# EasyEDA Pro project 小车2.0.eprj

# Schematic Schematic1
Create Date: 2024-05-27; Page Name: P1; Project Name: 小车2.0; Schematic Name: Schematic1; Update Date: 2024-06-13; Add into BOM: yes; Company: 嘉立创EDA; Convert to PCB: yes; Page Size: A4; Version: V1.0
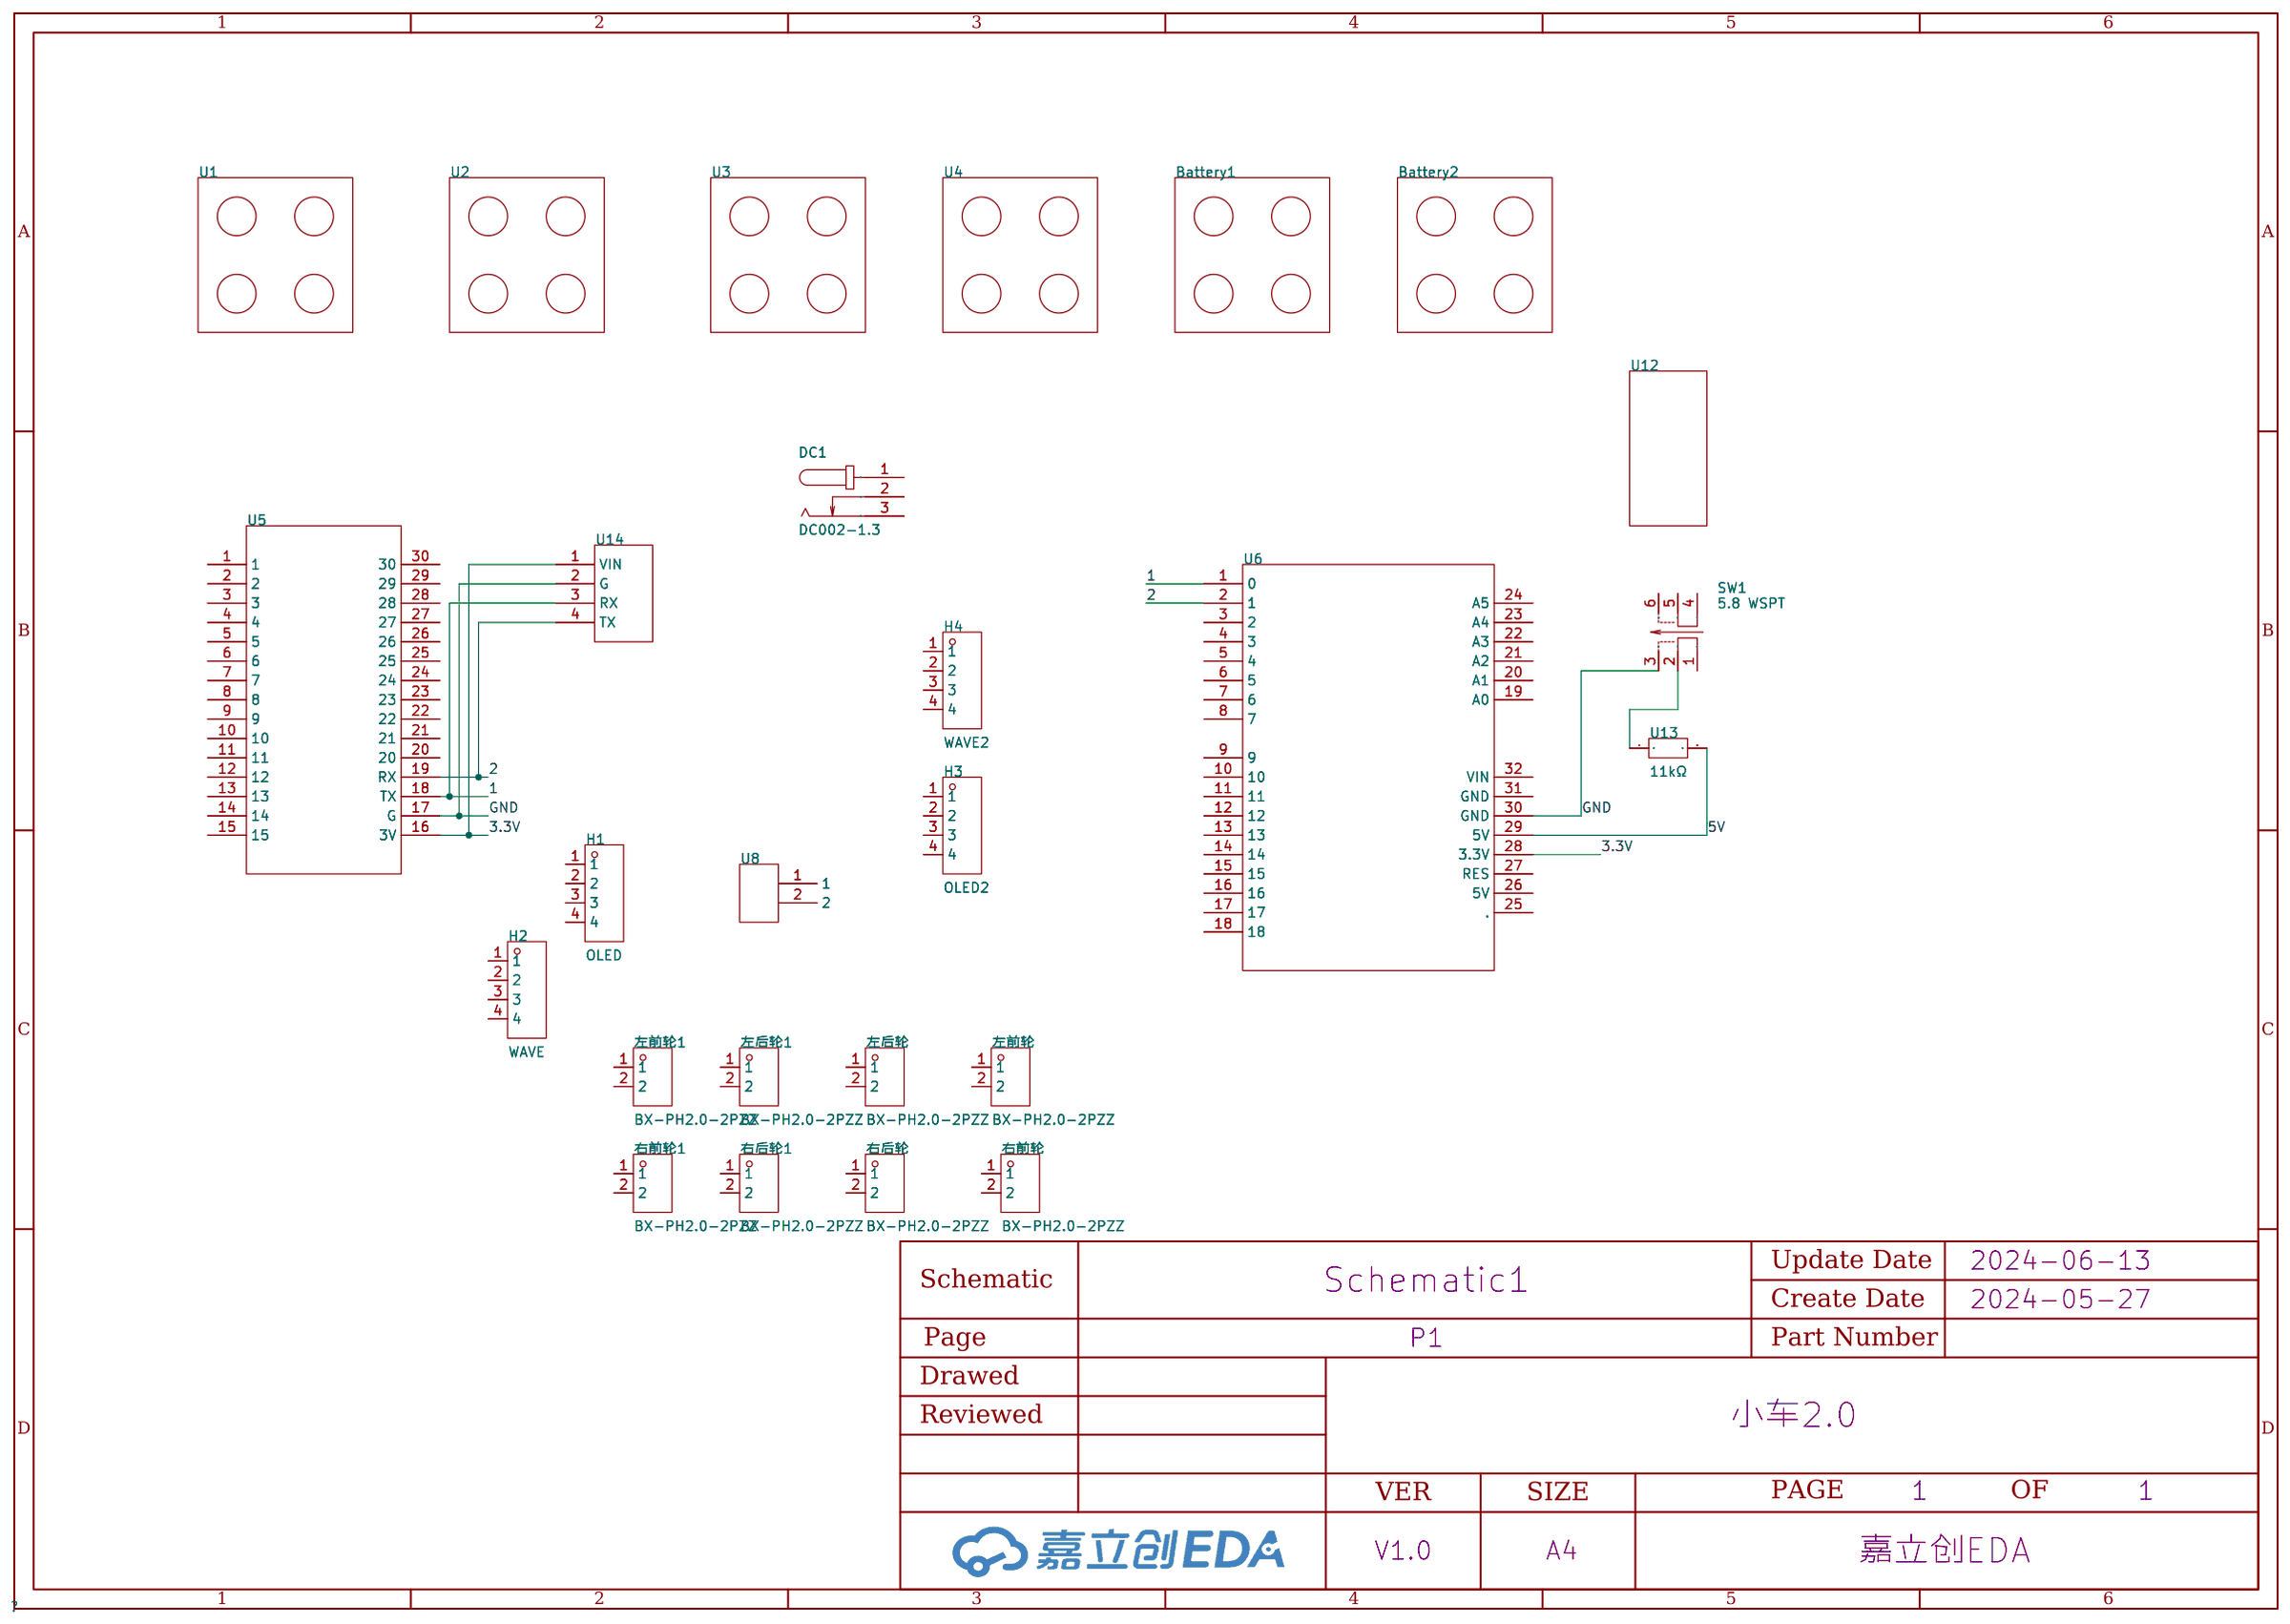
[diagram p0: schematic sheet]

## Parts
Battery1  -  [车轮]
Battery2  -  [车轮]
DC1  DC002-1.3  [DC-IN-TH_DC002-1.3]
H1  OLED  [HDR-TH_4P-P2.54-V-F]
H2  WAVE  [HDR-TH_4P-P2.54-V-F]
H3  OLED2  [HDR-TH_4P-P2.54-V-F]
H4  WAVE2  [HDR-TH_4P-P2.54-V-F]
SW1  5.8 WSPT  [SW-TH_6P-L5.8-W5.8-P2.00-LS4.5-TL_K8-5851E-L1]
U1  -  [车轮]
U2  -  [车轮]
U3  -  [车轮]
U4  -  [车轮]
U5  -  [蓝牙]
U6  -  [开发板]
U8  -  [开关]
U12  -  [舵机]
U13  11kΩ  [RES-TH_BD2.3-L6.0-P10.00-D0.6]
U14  -  [OPENMV]
右前轮  BX-PH2.0-2PZZ  [CONN-TH_2P-P2.00_BOSSIE_BX-PH2.0-2PZZ]
右前轮1  BX-PH2.0-2PZZ  [CONN-TH_2P-P2.00_BOSSIE_BX-PH2.0-2PZZ]
右后轮  BX-PH2.0-2PZZ  [CONN-TH_2P-P2.00_BOSSIE_BX-PH2.0-2PZZ]
右后轮1  BX-PH2.0-2PZZ  [CONN-TH_2P-P2.00_BOSSIE_BX-PH2.0-2PZZ]
左前轮  BX-PH2.0-2PZZ  [CONN-TH_2P-P2.00_BOSSIE_BX-PH2.0-2PZZ]
左前轮1  BX-PH2.0-2PZZ  [CONN-TH_2P-P2.00_BOSSIE_BX-PH2.0-2PZZ]
左后轮  BX-PH2.0-2PZZ  [CONN-TH_2P-P2.00_BOSSIE_BX-PH2.0-2PZZ]
左后轮1  BX-PH2.0-2PZZ  [CONN-TH_2P-P2.00_BOSSIE_BX-PH2.0-2PZZ]

## Library data of the parts
Battery1 Battery2 U1-U4 = 车轮
DC1 = DC002-1.3: 连接器类型:DC电源插座;安装方式:弯插;触点内径:1.3mm;触点外径:4.2mm;额定电流:500mA;额定电压:30V;工作温度范围:-;; LCSC Part Name: DC电源插座 内径:1.3mm 外径:4.2mm; Supplier Part: C668593; Manufacturer: SHOU HAN(首韩); Supplier Footprint: 插件; JLCPCB Part Class: 扩展库; Datasheet: https://atta.szlcsc.com/upload/public/pdf/source/20200619/C668593_6B5785499F122503841AA69BD23A954B.pdf; Supplier: LCSC; Connector Type: DC电源插座; Mounting Style: 弯插; Inside Contact Diameter: 1.3mm; Outside Contact Diameter: 4.2mm; Current Rating (Max): 500mA; Voltage Rating (Max): 30V
H1-H4 = PM254V-11-04-H85: 插孔结构:1x4P;间距:2.54mm;行距:-;安装类型:直插;排数:单排;总孔位数:4P;塑高:-;触头材质:黄铜;触头镀层:-;; LCSC Part Name: 间距:2.54mm 1x4P 直插; Supplier Part: C541851; Manufacturer: XFCN(兴飞); Supplier Footprint: 插件,P=2.54mm; JLCPCB Part Class: 扩展库; Datasheet: https://atta.szlcsc.com/upload/public/pdf/source/20200518/C541849_85853D71FC67C51915A806977A588FDA.pdf; Supplier: LCSC; Holes Structure: 1x4P; Pitch: 2.54mm; Mounting Type: 直插; Number of Rows: 单排; Number of Holes: 4P; Contact Material: 黄铜
SW1 = 5.8 WSPT: 电路结构:双刀双掷;自锁/无锁:无锁;安装方式:直插;触点电流:100mA;额定电压 (AC):-;额定电压 (DC):30V;带灯:不带;作用力:180gf;机械寿命:5千次;; LCSC Part Name: 按键开关5.8x5.8 无锁平头 180gf; Supplier Part: C5379898; Manufacturer: SHOU HAN(首韩); Supplier Footprint: 插件; JLCPCB Part Class: Extended Part; Datasheet: https://atta.szlcsc.com/upload/public/pdf/source/20230323/C831DDA43A625CDC196CB35781CDAE7F.pdf; Supplier: LCSC; Circuit: 双刀双掷; Self Lock / No Lock: 无锁; Actuator Style: 矩形柱塞; Mounting Style: 直插; Contact Current: 100mA; Voltage Rating (DC): 30V; Insulation Resistance: 100MΩ; Actuator/Cap Color: 蓝色; With Lamp: 不带; Pin Style: PC引脚; Operating Force: 180gf; Operating Temperature: -10℃~+70℃; Mechanical Life: 5千次
U5 = 蓝牙
U6 = 开发板
U8 = 开关
U12 = 舵机
U13 = RN55D1102FB14: 电阻类型:金属膜电阻;阻值:11kΩ;精度:±1%;功率:125mW;温度系数:±100ppm/℃;; LCSC Part Name: 金属膜电阻 11kΩ ±1% 125mW; Supplier Part: C1367638; Manufacturer: VISHAY(威世); Supplier Footprint: 插件,D2.3xL6.1mm; JLCPCB Part Class: 扩展库; Datasheet: https://atta.szlcsc.com/upload/public/pdf/source/20210608/50382EE0E4B78D1CB67FEFC4EAC5A602.pdf; Supplier: LCSC; Type: 金属膜电阻; Tolerance: ±1%; Power(Watts): 125mW; Temperature Coefficient: ±100ppm/℃; Operating Temperature Range: -65℃~+175℃
U14 = opnemv
右前轮 右前轮1 右后轮 右后轮1 左前轮 左前轮1 左后轮 左后轮1 = BX-PH2.0-2PZZ: 插针结构:1x2P;间距:2mm;安装方式:直插;参考系列:PH;总PIN数:2P;排数:1;每排PIN数:2;行距:-;额定电流:2A;触头材质:黄铜;触头镀层:锡;工作温度范围:-25℃~+85℃;; Supplier Part: C18077744; Manufacturer: Bossie(博锡); Supplier Footprint: 插件,P=2mm; JLCPCB Part Class: 扩展库; Datasheet: https://atta.szlcsc.com/upload/public/pdf/source/20231017/0F5D8A357D6F7BFB4F7225D5BDBA6EB1.pdf; Supplier: LCSC; Pins Structure: 1x2P; Pitch: 2mm; Mounting Style: 直插; Reference Series: PH; Number of Pins: 2P; Number of Rows: 1; Number of PINs Per Row: 2; Current Rating (Max): 2A; Contact Material: 黄铜; Contact Plating: 锡; Operating Temperature Range: -25℃~+85℃

## Nets
3.3V: U5.16(3V) U6.28(3.3V) U14.1(VIN)
5V: U6.29(5V) U13.2
GND: SW1.3 U5.17(G) U6.30(GND) U14.2(G)
1: U5.18(TX) U6.1(0) U14.3(RX)
2: U5.19(RX) U6.2(1) U14.4(TX)
Net-(SW1-2): SW1.2 U13.1

Not connected (* = marked no-connect by the designer): DC1 1 2 3; H1 1 2 3 4; H2 1 2 3 4; H3 1 2 3 4; H4 1 2 3 4; SW1 1 4 5 6; U5 1 2 3 4 5 6 7 8 9 10 11 12 13 14 15 20 21 22 23 24 25 26 27 28 29 30; U6 3(2) 4(3) 5(4) 6(5) 7(6) 8(7) 9 10 11 12 13 14 15 16 17 18 19(A0) 20(A1) 21(A2) 22(A3) 23(A4) 24(A5) 25(.) 26(5V) 27(RES) 31(GND) 32(VIN); U8 1 2; 右前轮 1 2; 右前轮1 1 2; 右后轮 1 2; 右后轮1 1 2; 左前轮 1 2; 左前轮1 1 2; 左后轮 1 2; 左后轮1 1 2

# Board PCB1
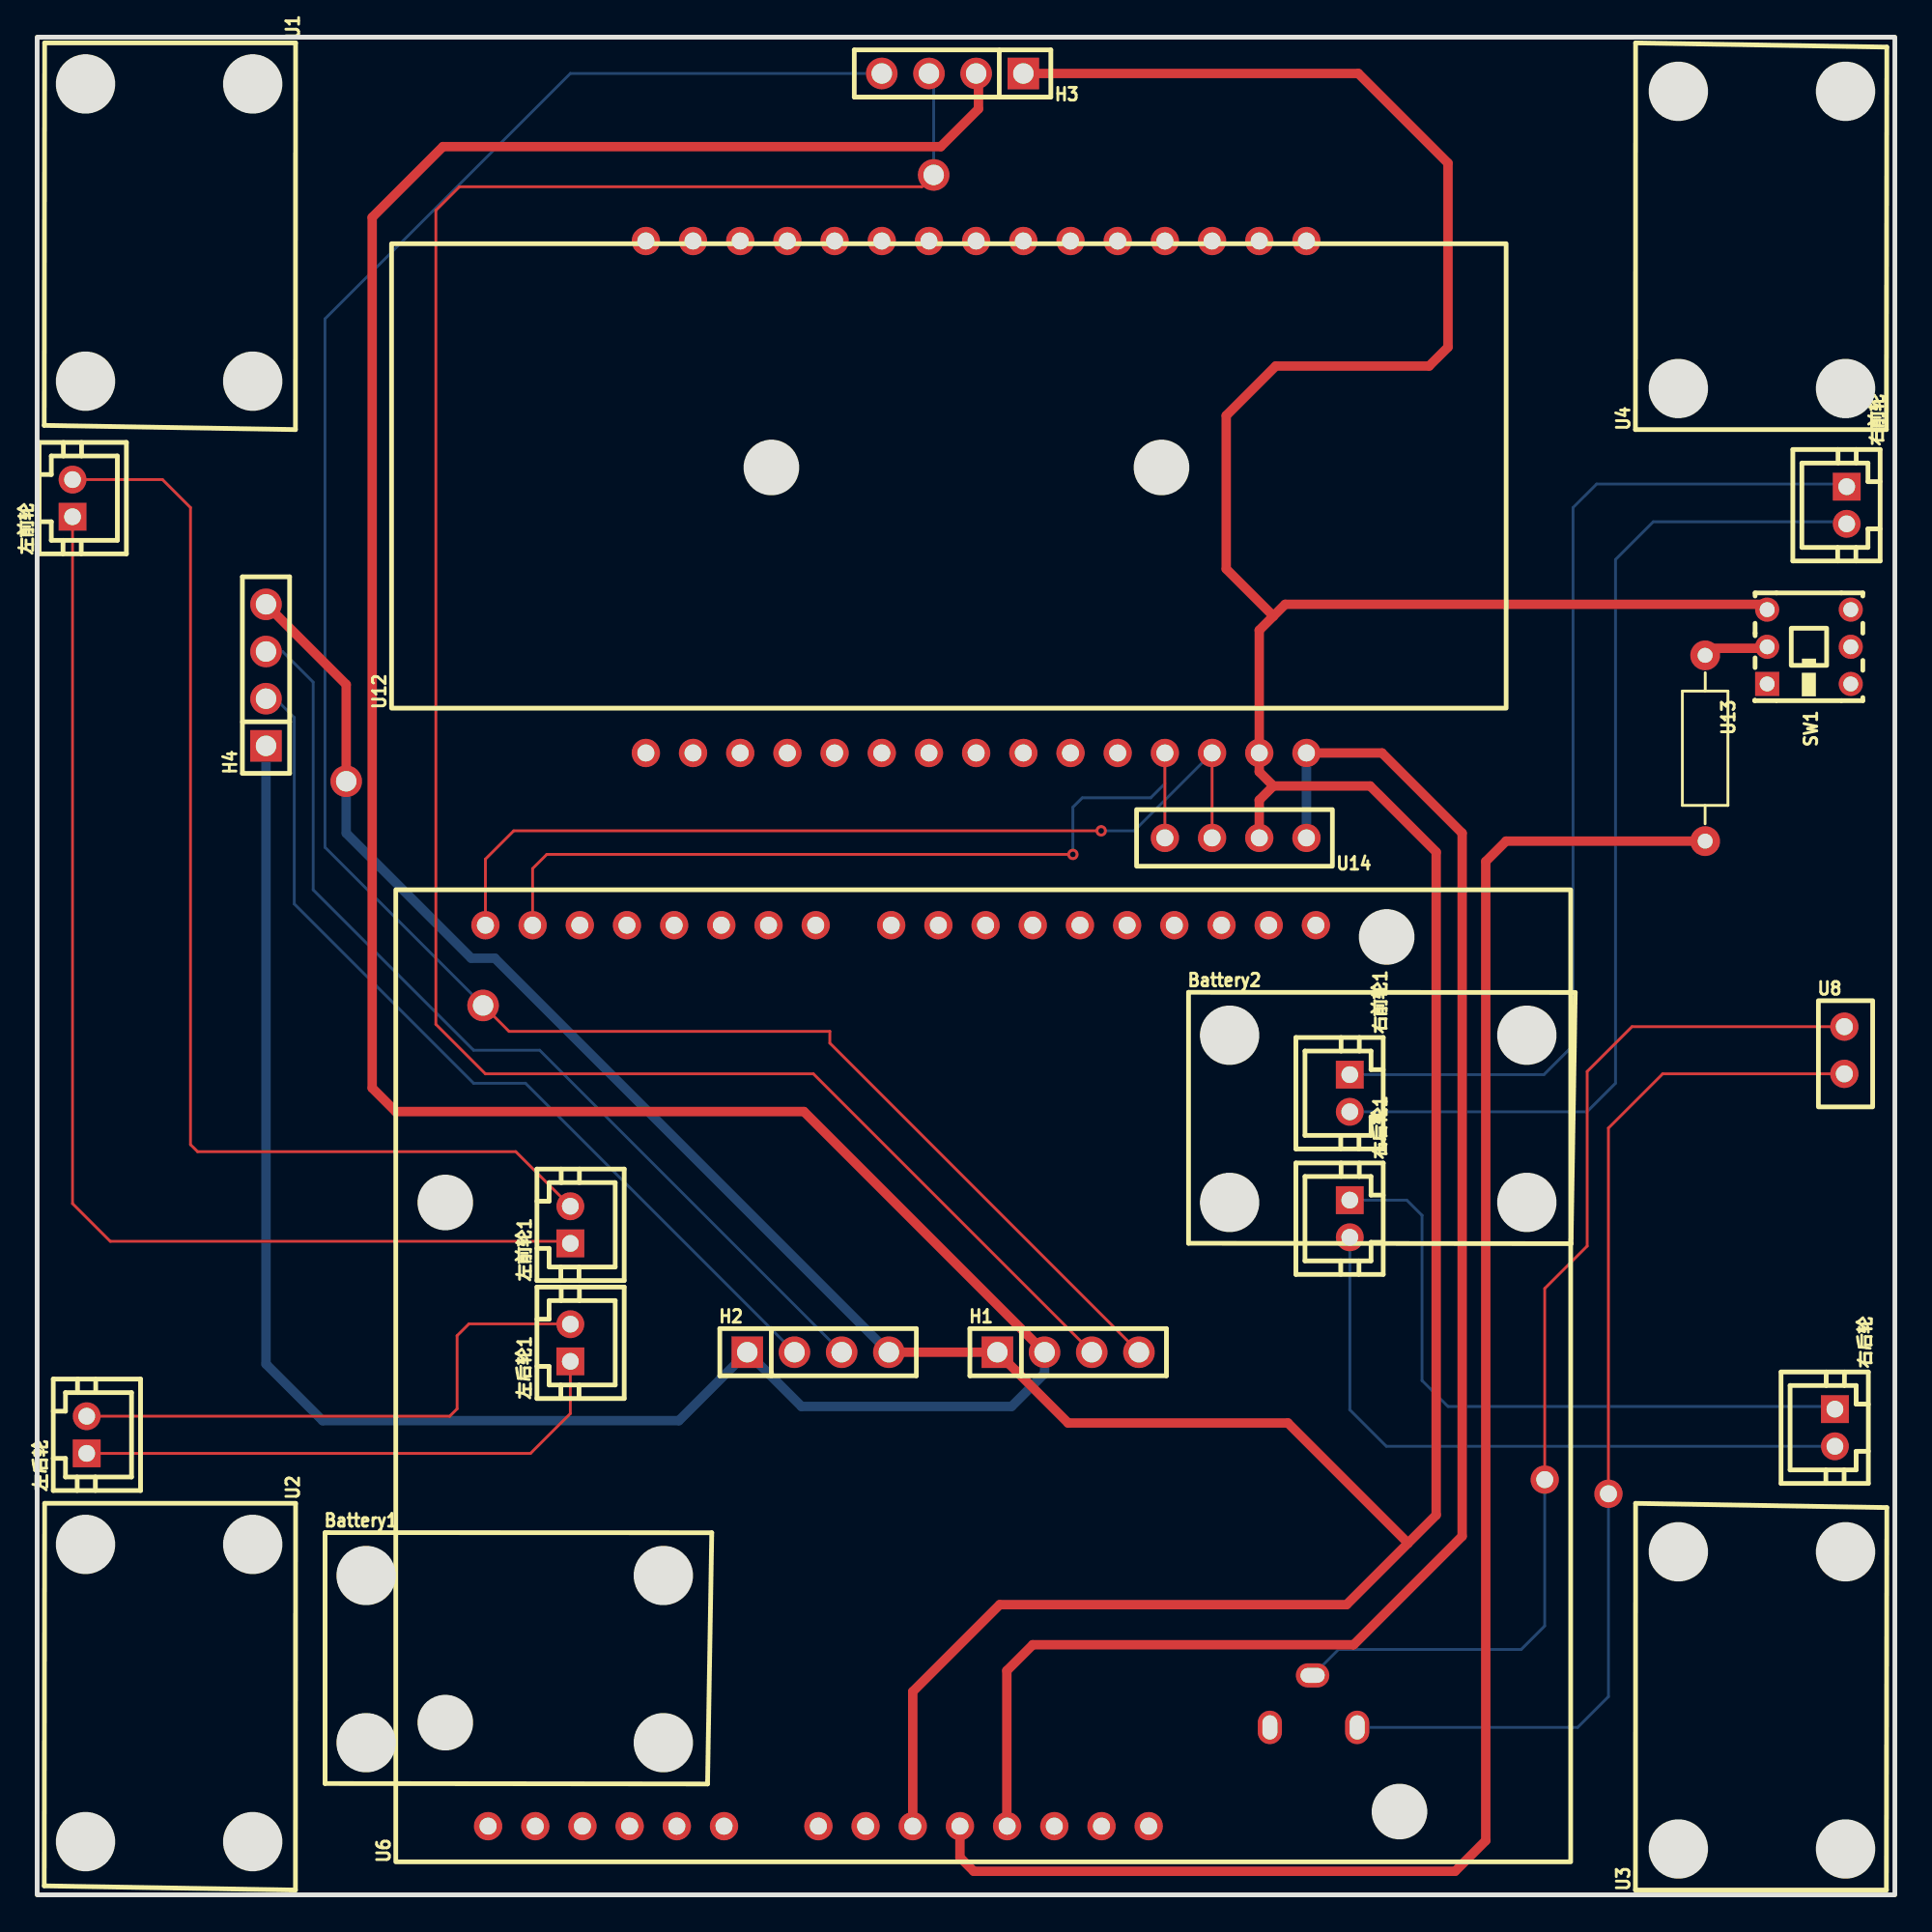
[diagram p1: board, top side]
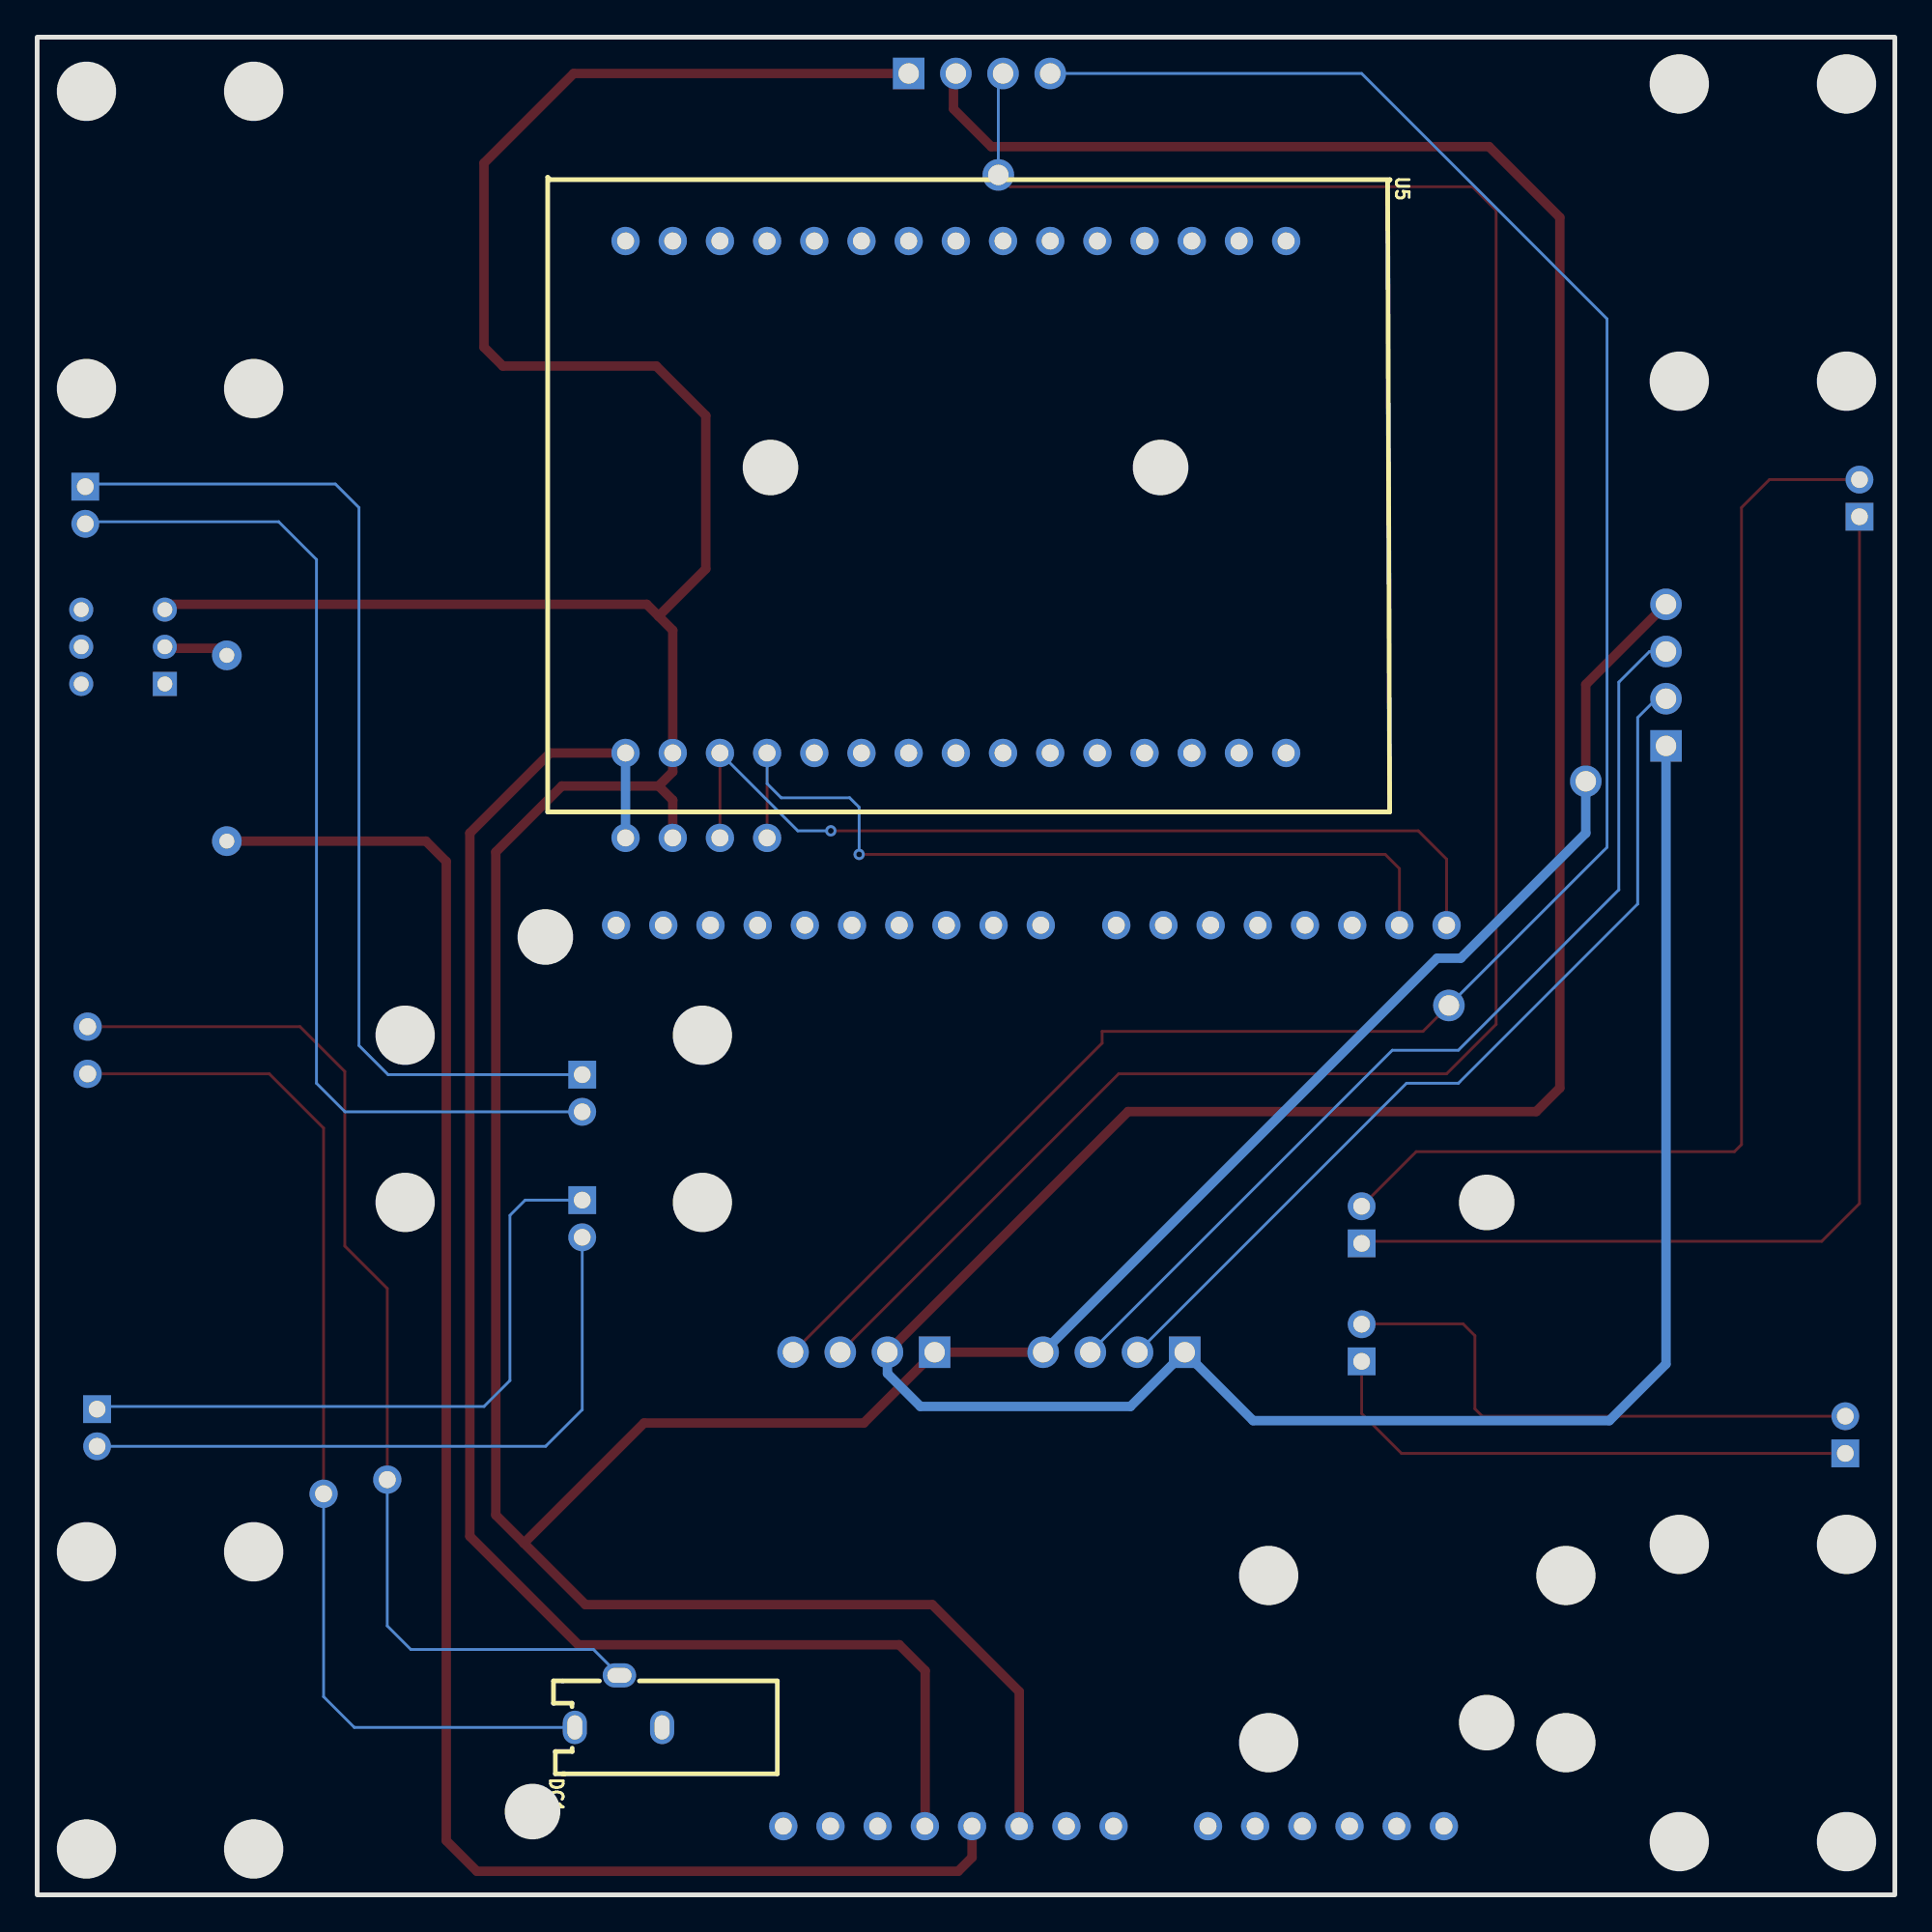
[diagram p2: board, bottom side, seen from below]

Outline 100 x 100 mm; copper layers: Top Layer, Bottom Layer. Coordinates in mm from the lower left corner of the outline.
Outline path: rectangle 0,100 100,0
Stack: Top Layer 0.035mm / Dielectric1 1.51mm FR4 er 4.5 / Bottom Layer 0.035mm

## Design rules (mm)
template: JLCPCB Capability(Two Layers Board)
spacing copperThickness1oz (default): track to track 0.102, other pairs 0.152 to 0.3
spacing copperThickness2oz: track to track 0.203, other pairs 0.152 to 0.3
track width copperThickness1oz (default): min 0.127, default 0.254, max 2.54
track width copperThickness2oz: min 0.203, default 0.254, max 2.54
differential pair differentialPair (default): width min 0.127, default 0.254, max 2.54; gap min 0.152, default 0.152
via viaSize (default): diameter min 0.5, default 0.61, max 10; hole min 0.3, default 0.305, max 6.3

## Placement (name value [footprint] x y rotation side)
Battery1  -  [车轮]  13.21 4.19 0 top
Battery2  -  [车轮]  59.69 33.27 0 top
DC1  DC002-1.3  [DC-IN-TH_DC002-1.3]  68.71 10.41 90 bottom
H1  OLED  [HDR-TH_4P-P2.54-V-F]  55.5 29.21 0 top
H2  WAVE  [HDR-TH_4P-P2.54-V-F]  42.04 29.21 0 top
H3  OLED2  [HDR-TH_4P-P2.54-V-F]  49.28 98.04 180 top
H4  WAVE2  [HDR-TH_4P-P2.54-V-F]  12.32 65.66 90 top
NOREF  -  [Pad_e153]  48.26 92.58 180 top
NOREF#2  -  [Pad_e253]  16.64 59.94 90 top
NOREF#3  -  [Pad_e154]  24.01 47.88 180 top
NOREF#4  -  [Pad_e236]  81.15 22.35 0 top
NOREF#5  -  [Pad_e220]  84.58 21.59 0 top
SW1  5.8 WSPT  [SW-TH_6P-L5.8-W5.8-P2.00-LS4.5-TL_K8-5851E-L1]  95.38 67.18 90 top
U1  -  [车轮]  -1.4 101.98 270 top
U2  -  [车轮]  -1.4 23.36 270 top
U3  -  [车轮]  101.35 -2.03 90 top
U4  -  [车轮]  101.35 76.58 90 top
U5  -  [蓝牙]  68.33 89.03 270 bottom
U6  -  [开发板]  68.83 6.86 90 top
U8  -  [开关]  97.28 44.2 0 top
U12  -  [舵机]  39.75 76.83 90 top
U13  11kΩ  [RES-TH_BD2.3-L6.0-P10.00-D0.6]  89.79 61.72 270 top
U14  -  [OPENMV]  68.33 56.9 180 top
右前轮  BX-PH2.0-2PZZ  [CONN-TH_2P-P2.00_BOSSIE_BX-PH2.0-2PZZ]  97.41 74.8 270 top
右前轮1  BX-PH2.0-2PZZ  [CONN-TH_2P-P2.00_BOSSIE_BX-PH2.0-2PZZ]  70.66 43.15 270 top
右后轮  BX-PH2.0-2PZZ  [CONN-TH_2P-P2.00_BOSSIE_BX-PH2.0-2PZZ]  96.77 25.15 270 top
右后轮1  BX-PH2.0-2PZZ  [CONN-TH_2P-P2.00_BOSSIE_BX-PH2.0-2PZZ]  70.66 36.4 270 top
左前轮  BX-PH2.0-2PZZ  [CONN-TH_2P-P2.00_BOSSIE_BX-PH2.0-2PZZ]  1.91 75.18 90 top
左前轮1  BX-PH2.0-2PZZ  [CONN-TH_2P-P2.00_BOSSIE_BX-PH2.0-2PZZ]  28.7 36.07 90 top
左后轮  BX-PH2.0-2PZZ  [CONN-TH_2P-P2.00_BOSSIE_BX-PH2.0-2PZZ]  2.67 24.76 90 top
左后轮1  BX-PH2.0-2PZZ  [CONN-TH_2P-P2.00_BOSSIE_BX-PH2.0-2PZZ]  28.7 29.72 90 top

## Footprints (pads in the part's own frame, mm; a bottom-side part is the same pattern mirrored in y, then rotated)
CONN-TH_2P-P2.00_BOSSIE_BX-PH2.0-2PZZ
  rect 1.5x1.5 hole 0.9: 1(-1,0)
  round 1.5 hole 0.9: 2(1,0)
DC-IN-TH_DC002-1.3
  oval 1.8x1.3 hole 1.3x0.8: 1(-1.4,2.35) 3(-1.4,-2.35)
  oval 1.3x1.8 hole 0.8x1.3: 2(1.4,-0.05)
HDR-TH_4P-P2.54-V-F
  rect 1.7x1.7 hole 1.1: 1(-3.81,0)
  round 1.7 hole 1.1: 2(-1.27,0) 3(1.27,0) 4(3.81,0)
OPENMV
  round 1.524 hole 0.914: 1(0,0) 2(2.54,0) 3(5.08,0) 4(7.62,0)
Pad_e153
  round 1.7 hole 1.1: 35(0,0)
Pad_e154
  round 1.7 hole 1.1: 36(0,0)
Pad_e220
  round 1.524 hole 0.914: 33(0,0)
Pad_e236
  round 1.524 hole 0.914: 34(0,0)
Pad_e253
  round 1.7 hole 1.1: 37(0,0)
RES-TH_BD2.3-L6.0-P10.00-D0.6
  round 1.6 hole 0.8: 1(-5,0) 2(5,0)
SW-TH_6P-L5.8-W5.8-P2.00-LS4.5-TL_K8-5851E-L1
  rect 1.3x1.3 hole 0.8: 1(-2,2.25)
  round 1.3 hole 0.8: 2(0,2.25) 3(2,2.25) 4(-2,-2.25) 5(0,-2.25) 6(2,-2.25)
开关
  round 1.524 hole 0.914: 1(0,0) 2(0,2.54)
开发板
  round 1.524 hole 0.914: 1(45.339,44.704) 2(45.339,42.164) 3(45.339,39.624) 4(45.339,37.084) 5(45.339,34.544) 6(45.339,32.004) 7(45.339,29.464) 8(45.339,26.924) 9(45.339,22.86) 10(45.339,20.32) 11(45.339,17.78) 12(45.339,15.24) 13(45.339,12.7) 14(45.339,10.16) 15(45.339,7.62) 16(45.339,5.08) 17(45.339,2.54) 18(45.339,0) 19(-3.161,44.56) 20(-3.161,42.02) 21(-3.161,39.48) 22(-3.161,36.94) 23(-3.161,34.4) 24(-3.161,31.86) 25(-3.161,26.779) 26(-3.161,24.24) 27(-3.161,21.7) 28(-3.161,19.16) 29(-3.161,16.62) 30(-3.161,14.08) 31(-3.161,11.54) 32(-3.161,9)
蓝牙
  round 1.524 hole 0.914: 1(0,35.56) 2(0,33.02) 3(0,30.48) 4(0,27.94) 5(0,25.4) 6(0,22.86) 7(0,20.32) 8(0,17.78) 9(0,15.24) 10(0,12.7) 11(0,10.16) 12(0,7.62) 13(0,5.08) 14(0,2.54) 15(0,0) 16(27.559,0) 17(27.559,2.54) 18(27.559,5.08) 19(27.559,7.62) 20(27.559,10.16) 21(27.559,12.7) 22(27.559,15.24) 23(27.559,17.78) 24(27.559,20.32) 25(27.559,22.86) 26(27.559,25.4) 27(27.559,27.94) 28(27.559,30.48) 29(27.559,33.02) 30(27.559,35.56)

## Nets
3.3V: U5.16 U6.29 U14.1
5V: U6.28 U13.2
GND: H1.1 H2.4 H3.1 H4.4 NOREF#2.37 SW1.3 U5.17 U6.27 U14.2
VCC: H1.2 H2.1 H3.2 H4.1
1: U5.18 U6.1 U14.3
2: U5.19 U6.2 U14.4
ECHO: H2.3 H4.3
SCL: H1.3 H3.3 NOREF.35
SDA: H1.4 H3.4 NOREF#3.36
TRIG: H2.2 H4.2

Pads without a net: DC1 1 2 3; NOREF#4 34; NOREF#5 33; SW1 1 2 4 5 6; U5 1 2 3 4 5 6 7 8 9 10 11 12 13 14 15 20 21 22 23 24 25 26 27 28 29 30; U6 3 4 5 6 7 8 9 10 11 12 13 14 15 16 17 18 19 20 21 22 23 24 25 26 30 31 32; U8 1 2; U13 1; 右前轮 1 2; 右前轮1 1 2; 右后轮 1 2; 右后轮1 1 2; 左前轮 1 2; 左前轮1 1 2; 左后轮 1 2; 左后轮1 1 2

## Via types
v1: diameter 0.61, hole 0.305, Top Layer to Bottom Layer, 2 vias

## Routing (per net, layer and track width the routed paths; a pad name or vN(x,y) marks a point on that pad's centre or on a via; arc(x,y) is an arc through that point)
3.3V: length 88.9
  Top Layer w0.508: U5.16 72.39,61.47 76.71,57.15 76.71,19.3 70.87,13.46 53.59,13.46 52.2,12.06 52.2,3.71 U6.29 52.21,3.32 52.2,3.3
  Bottom Layer w0.508: U14.1 U5.16
5V: length 95.9
  Top Layer w0.508: U6.28 49.67,2.01 50.42,1.27 76.33,1.27 77.98,2.92 77.98,55.63 79.07,56.72 U13.2
GND: length 272.3
  Top Layer w0.508: 66.55,68.83 65.79,68.07 U5.17 65.79,60.45 66.55,59.69 ; 66.55,68.83 64.01,71.37 64.01,79.63 66.68,82.3 74.93,82.3 75.95,83.31 75.95,93.22 71.12,98.04 53.02,98.04 ; 66.55,68.83 67.18,69.47 92.84,69.47 93.09,69.22 ; 73.8,18.93 67.33,25.4 55.5,25.4 H1.1 H2.4 ; 73.8,18.93 75.31,20.45 75.31,56.13 71.75,59.69 66.55,59.69 ; 73.8,18.93 70.49,15.62 51.82,15.62 47.13,10.94 U6.27 ; NOREF#2.37 16.64,65.15 12.32,69.47 ; U14.2 65.79,58.93 66.55,59.69
  Bottom Layer w0.508: NOREF#2.37 16.64,57.15 23.37,50.42 24.64,50.42 H2.4
VCC: length 207
  Top Layer w0.508: H3.2 50.67,97.92 50.67,96.14 48.64,94.11 21.84,94.11 18.03,90.3 18.03,43.43 19.3,42.16 41.28,42.16 H1.2
  Bottom Layer w0.508: H4.1 12.32,28.57 15.37,25.53 34.54,25.53 H2.1 41.15,26.29 52.45,26.29 54.23,28.07 H1.2
(no net): length 494.5
  Top Layer w0.152: 左后轮1.1 28.7,25.91 26.56,23.76 左后轮.1 ; 左后轮1.2 28.69,30.73 23.24,30.73 22.61,30.1 22.61,26.16 22.21,25.76 左后轮.2 ; NOREF#5.33 84.58,41.28 87.5,44.2 U8.1 ; 左前轮1.1 28.59,35.18 3.94,35.18 1.91,37.21 左前轮.1 ; NOREF#4.34 81.15,32.64 83.44,34.92 83.44,44.32 85.85,46.74 U8.2 ; 左前轮1.2 25.77,40 8.64,40 8.25,40.39 8.25,74.68 6.75,76.18 左前轮.2
  Top Layer w0.508: 92.73,67.1 90.17,67.1 U13.1
  Bottom Layer w0.152: 右前轮.2 97.3,73.91 87,73.91 84.96,71.88 84.96,43.69 83.43,42.15 右前轮1.2 ; 右后轮.2 72.63,24.15 70.66,26.12 右后轮1.2 ; DC1.1 82.93,9.01 84.58,10.67 NOREF#5.33 ; NOREF#4.34 81.15,14.48 79.88,13.21 70.05,13.21 DC1.2 ; 右前轮.1 97.27,75.95 83.95,75.95 82.68,74.68 82.68,45.72 81.11,44.15 右前轮1.1 ; 右后轮.1 96.63,26.29 75.95,26.29 74.55,27.69 74.55,36.58 73.73,37.4 右后轮1.1
1: length 49.6
  Top Layer w0.152: U6.1 24.13,55.75 25.65,57.28 v1(57.28,57.28) ; U5.18 U14.3
  Bottom Layer w0.152: U5.18 59.06,57.28 v1(57.28,57.28)
2: length 46.7
  Top Layer w0.152: v1(55.75,56.01) 27.43,56.01 26.67,55.25 U6.2 ; U5.19 U14.4
  Bottom Layer w0.152: U5.19 60.71,59.82 59.94,59.06 56.26,59.06 55.75,58.55 v1(55.75,56.01)
ECHO: length 53.2
  Bottom Layer w0.152: H4.3 13.21,66.93 14.86,65.28 14.86,54.1 23.5,45.47 27.05,45.47 H2.3
SCL: length 119.6
  Top Layer w0.152: H1.3 41.78,44.2 24.13,44.2 21.46,46.86 21.46,90.68 22.73,91.95 47.62,91.95 NOREF.35
  Bottom Layer w0.152: NOREF.35 48.26,97.79 H3.3
SDA: length 119.7
  Top Layer w0.152: 23.75,48.13 25.4,46.48 42.67,46.48 42.67,45.85 H1.4
  Bottom Layer w0.152: H3.4 28.7,98.04 15.49,84.84 15.49,56.39 NOREF#3.36
TRIG: length 48.9
  Bottom Layer w0.152: H2.2 26.29,43.69 23.5,43.69 13.84,53.34 13.84,63.37 12.83,64.39 12.32,64.39
